# EAGLE design Controller (EAGLE 9.4.2)
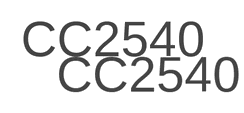
[diagram p0: schematic, sheet 1, part 1 of 3]
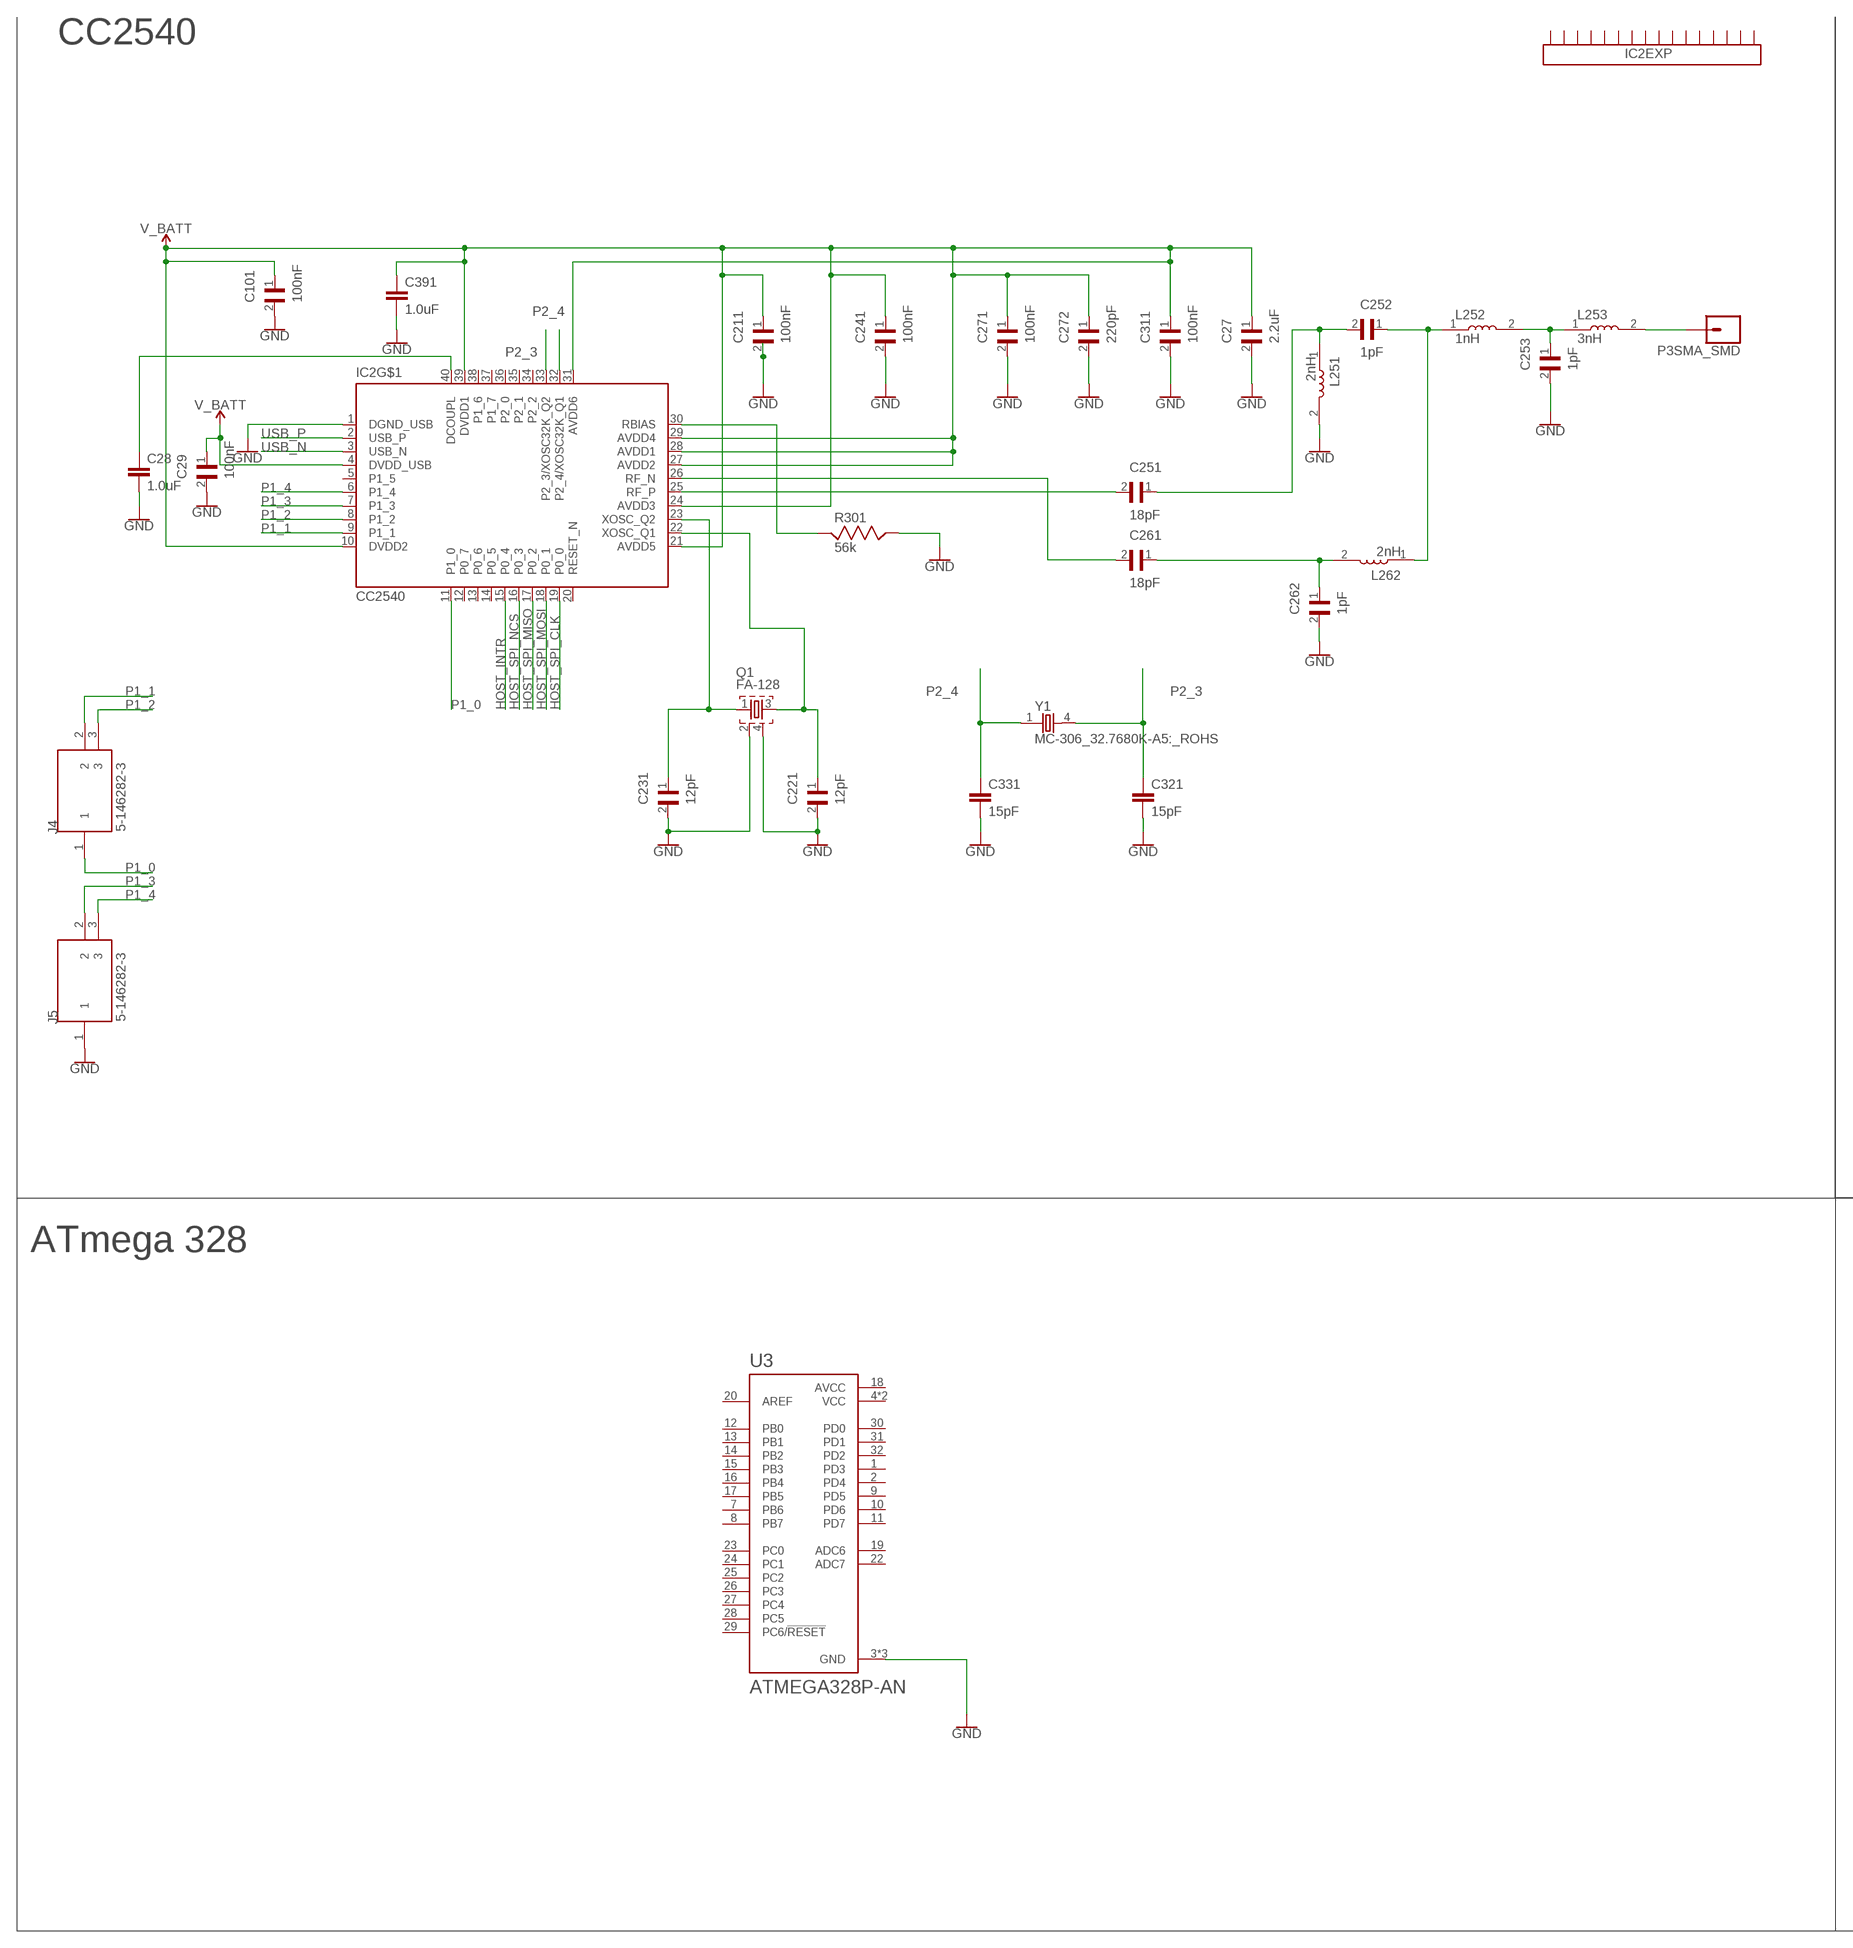
[diagram p1: schematic, sheet 1, part 2 of 3]
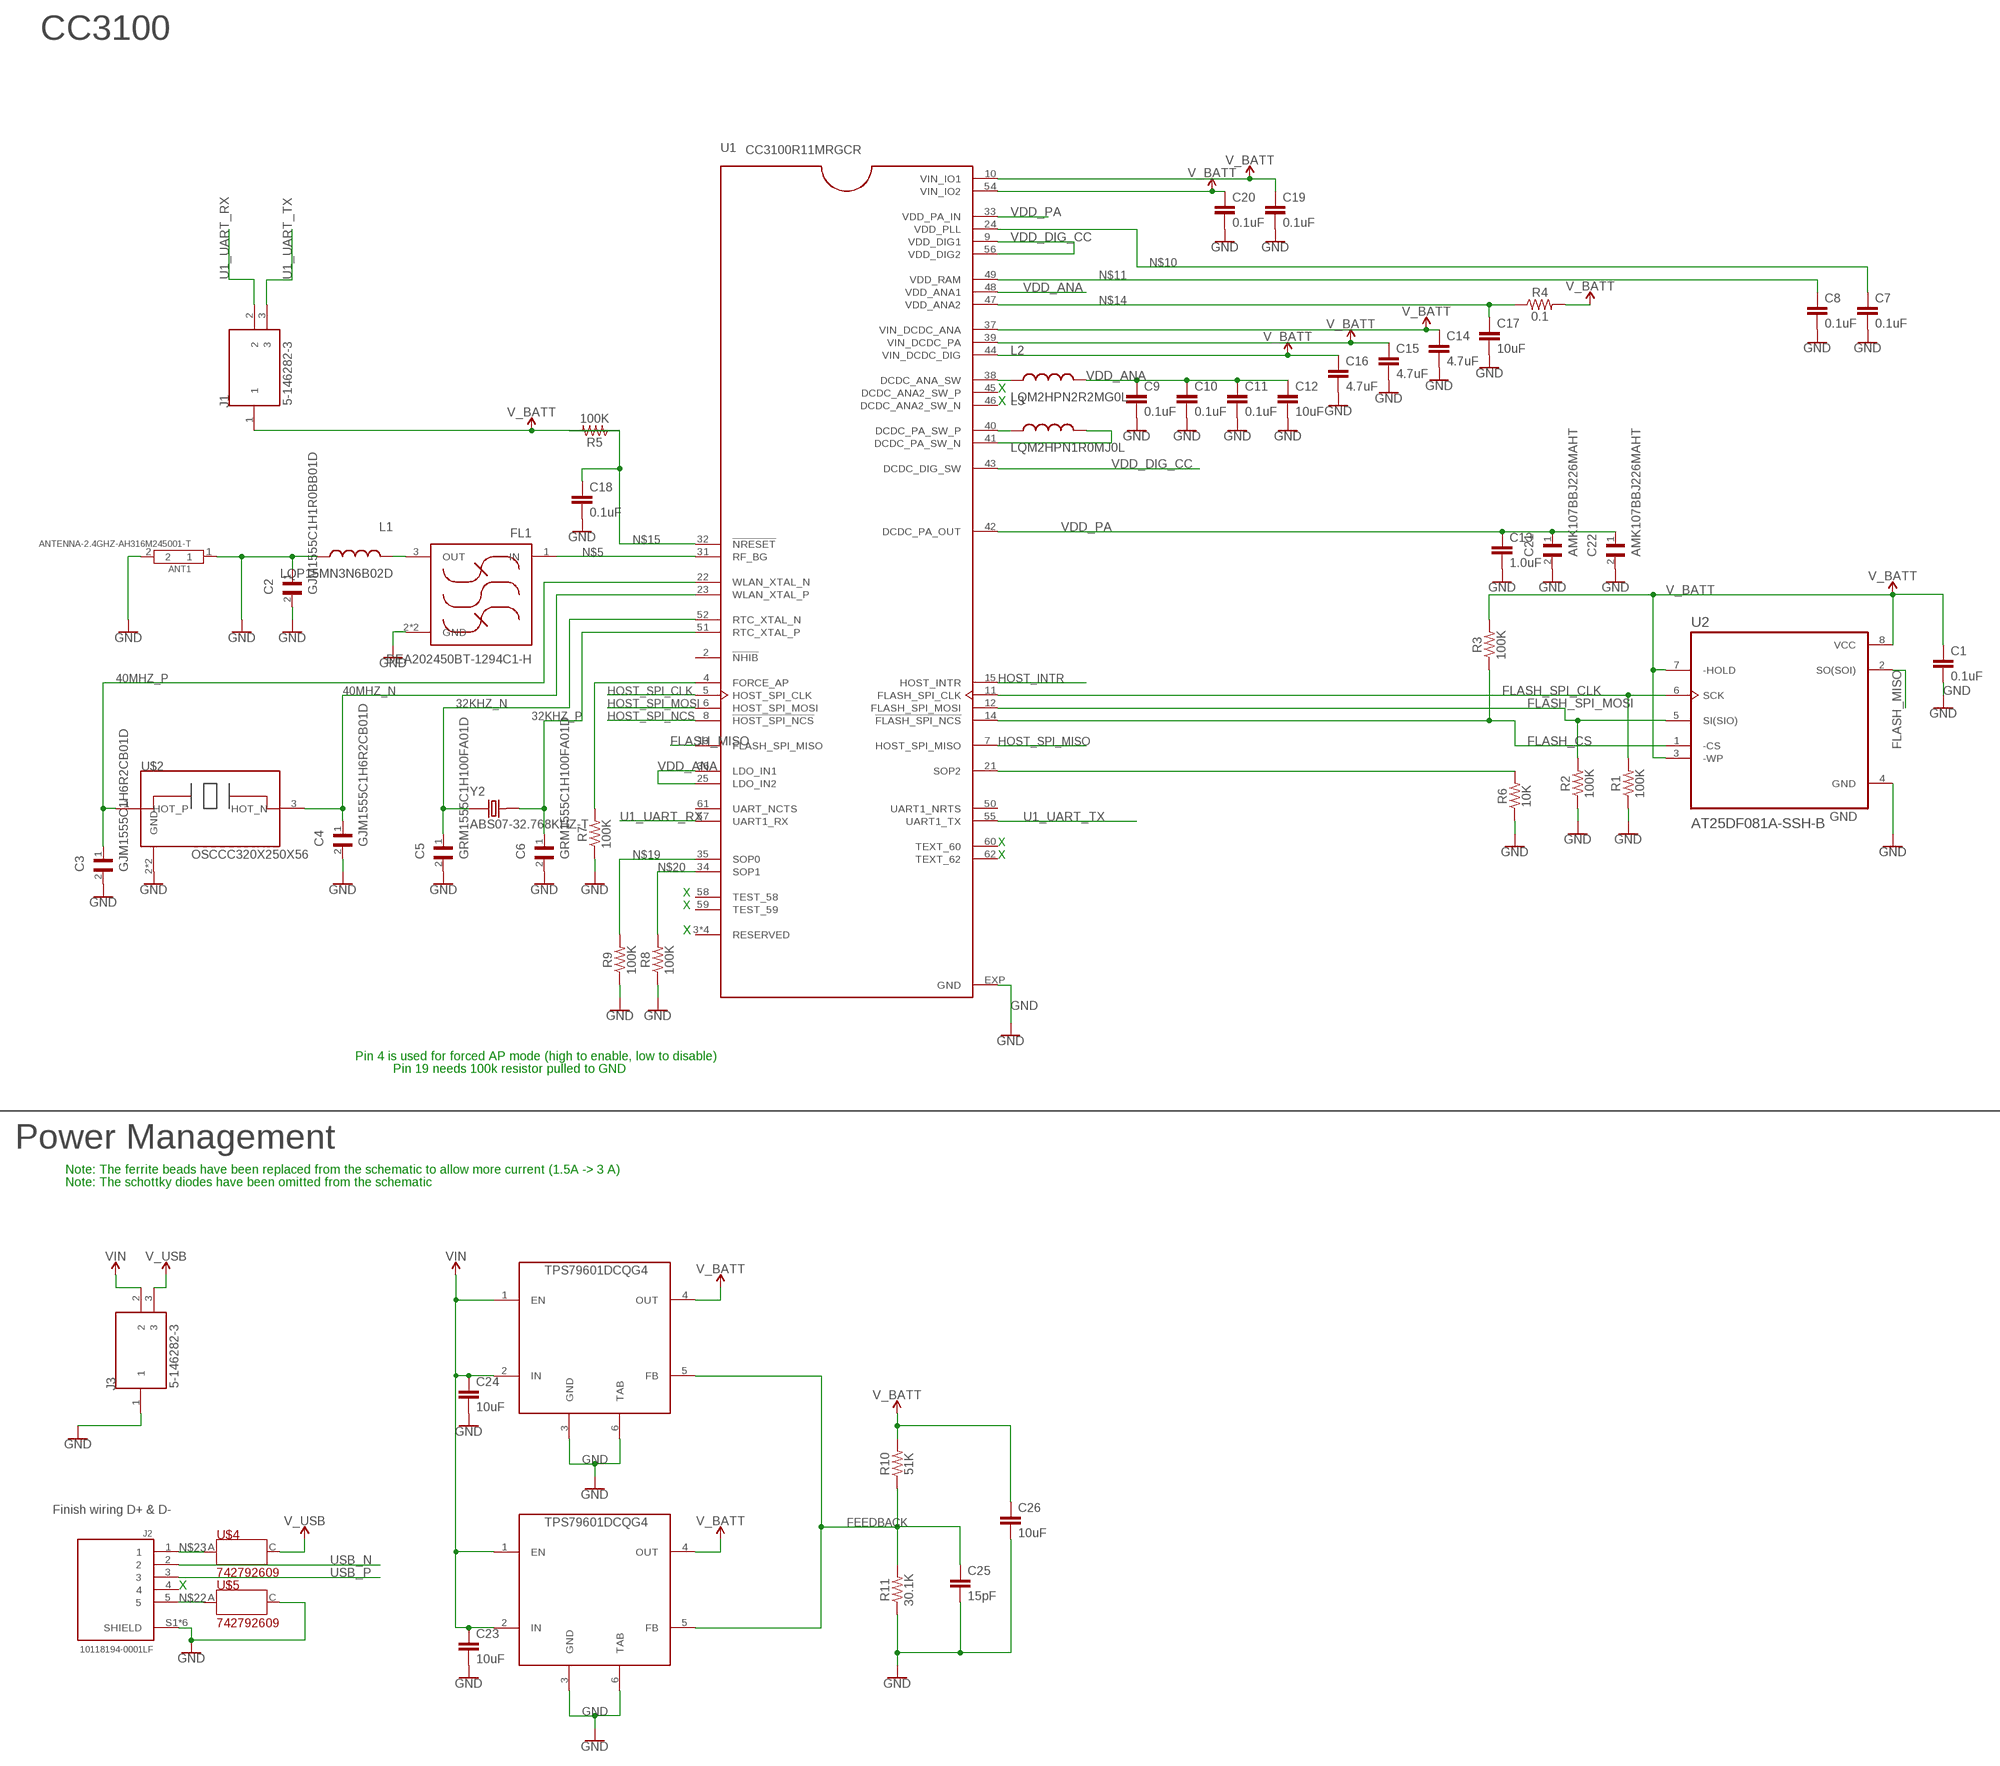
[diagram p2: schematic, sheet 1, part 3 of 3]

## Parts
ANT1  ANTENNA-2.4GHZ-AH316M245001-T  [ANT2-SMD-3.2X1.6X0.5MM]
C1  0.1uF  0.1UF-0402-16V-10%  [0402]
C2  GJM1555C1H1R0BB01D  [CAPC1005X55N]
C3  GJM1555C1H6R2CB01D  [CAPC1005X55N]
C4  GJM1555C1H6R2CB01D  [CAPC1005X55N]
C5  GRM1555C1H100FA01D  [CAPC1005X55N]
C6  GRM1555C1H100FA01D  [CAPC1005X55N]
C7  0.1uF  0.1UF-0402-16V-10%  [0402]
C8  0.1uF  0.1UF-0402-16V-10%  [0402]
C9  0.1uF  0.1UF-0402-16V-10%  [0402]
C10  0.1uF  0.1UF-0402-16V-10%  [0402]
C11  0.1uF  0.1UF-0402-16V-10%  [0402]
C12  10uF  10UF-0603-6.3V-20%  [0603]
C13  1.0uF  1.0UF-0402-16V-10%  [0402]
C14  4.7uF  4.7UF-0402_TIGHT-6.3V-20%-X5R  [0402-TIGHT]
C15  4.7uF  4.7UF-0402_TIGHT-6.3V-20%-X5R  [0402-TIGHT]
C16  4.7uF  4.7UF-0402_TIGHT-6.3V-20%-X5R  [0402-TIGHT]
C17  10uF  10UF-0603-6.3V-20%  [0603]
C18  0.1uF  0.1UF-0402-16V-10%  [0402]
C19  0.1uF  0.1UF-0402-16V-10%  [0402]
C20  0.1uF  0.1UF-0402-16V-10%  [0402]
C21  AMK107BBJ226MAHT  [CAPC1608X95N]
C22  AMK107BBJ226MAHT  [CAPC1608X95N]
C23  10uF  10UF-0603-6.3V-20%  [0603]
C24  10uF  10UF-0603-6.3V-20%  [0603]
C25  15pF  15PF-0402-50V-5%  [0402]
C26  10uF  10UF-0603-6.3V-20%  [0603]
C27  2.2uF  GRM155C81C225ME15D  [CAPC1005X55N]
C28  1.0uF  1.0UF-0402-16V-10%  [0402]
C29  100nF  C0402C104Z8VACTU  [CAPC1005X55N]
C101  100nF  C0402C104Z8VACTU  [CAPC1005X55N]
C211  100nF  C0402C104Z8VACTU  [CAPC1005X55N]
C221  12pF  C0402C120C8GACTU  [CAPC1005X55N]
C231  12pF  C0402C120C8GACTU  [CAPC1005X55N]
C241  100nF  C0402C104Z8VACTU  [CAPC1005X55N]
C251  18pF  CBR04C180J5GAC  [CAPC1005X55N]
C252  1pF  C0402C104Z8VACTU  [CAPC1005X55N]
C253  1pF  GJM1555C1H1R0BB01D  [CAPC1005X55N]
C261  18pF  CBR04C180J5GAC  [CAPC1005X55N]
C262  1pF  GJM1555C1H1R0BB01D  [CAPC1005X55N]
C271  100nF  C0402C104Z8VACTU  [CAPC1005X55N]
C272  220pF  C0402C221K8RACTU  [CAPC1005X55N]
C311  100nF  C0402C104Z8VACTU  [CAPC1005X55N]
C321  15pF  15PF-0402-50V-5%  [0402]
C331  15pF  15PF-0402-50V-5%  [0402]
C391  1.0uF  1.0UF-0402-16V-10%  [0402]
FL1  DEA202450BT-1294C1-H  [FIL_DEA202450BT-1294C1-H]
IC2  CC2540  [QFN40-6X6]
J1  5-146282-3  [TE_5-146282-3]
J2  10118194-0001LF  [AMPHENOL_10118194-0001LF]
J3  5-146282-3  [TE_5-146282-3]
J4  5-146282-3  [TE_5-146282-3]
J5  5-146282-3  [TE_5-146282-3]
L1  LQP15MN3N6B02D  [INDC0402X01]
L2  LQM2HPN2R2MG0L  [INDC1008X04]
L3  LQM2HPN1R0MJ0L  [INDC1008X04]
L251  2nH  LQG15HS2N0S02D  [INDC1005X45]
L252  1nH  LQG15HS1N0S02D  [INDC1005X45]
L253  3nH  LQG15HS3N0S02D  [INDC1005X45]
L262  2nH  LQG15HS2N0S02D  [INDC1005X45]
P3SMA_SMD  CONN_01  [1X01]
Q1  FA-128  [FA-128]
R1  100K  100KOHM-0402-1/16W-1%  [0402]
R2  100K  100KOHM-0402-1/16W-1%  [0402]
R3  100K  100KOHM-0402-1/16W-1%  [0402]
R4  0.1  0OHM-0603-1/10W  [0603]
R5  100K  100KOHM-0402-1/16W-1%  [0402]
R6  10K  100KOHM-0402-1/16W-1%  [0402]
R7  100K  100KOHM-0402-1/16W-1%  [0402]
R8  100K  100KOHM-0402-1/16W-1%  [0402]
R9  100K  100KOHM-0402-1/16W-1%  [0402]
R10  51K  22OHM-0402-1/10W-1%  [0402]
R11  30.1K  22OHM-0402-1/10W-1%  [0402]
R301  56k  RC0402FR-1356KL  [RESC1005X40]
U1  CC3100R11MRGCR  [QFN50P900X900X100-65N]
U2  AT25DF081A-SSH-B  [SOIC127P600X175-8N]
U3  ATMEGA328P-AN  [QFP80P900X900X120-32N]
U$1  TPS79601DCQG4  [SOT127P706X180-6N]
U$2  OSCCC320X250X56  [OSCCC320X250X56]
U$3  TPS79601DCQG4  [SOT127P706X180-6N]
U$4  742792609  [LEDM1608X80]
U$5  742792609  [LEDM1608X80]
Y1  MC-306_32.7680K-A5:_ROHS  [OSCL550P800X320X254-4N]
Y2  ABS07-32.768KHZ-T  [XTAL_ABS07-32.768KHZ-T]

## Nets
32KHZ_N: C5.1 U1.52(RTC_XTAL_N) Y2.1
32KHZ_P: C6.1 U1.51(RTC_XTAL_P) Y2.2
40MHZ_N: C4.1 U1.23(WLAN_XTAL_P) U$2.3(HOT_N)
40MHZ_P: C3.1 U1.22(WLAN_XTAL_N) U$2.1(HOT_P)
FEEDBACK: C25.1 R10.1 R11.2 U$1.5(FB) U$3.5(FB)
FLASH_CS: R3.1 U1.14(!FLASH_SPI_NCS) U2.1(-CS)
FLASH_MISO: U1.13(FLASH_SPI_MISO) U2.2(SO(SOI))
FLASH_SPI_CLK: R1.2 U1.11(FLASH_SPI_CLK) U2.6(SCK)
FLASH_SPI_MOSI: R2.2 U1.12(FLASH_SPI_MOSI) U2.5(SI(SIO))
GND: ANT1.1 ANT1.2 C1.2 C2.1 C2.2 C3.2 C4.2 C5.2 C6.2 C7.2 C8.2 C9.2 C10.2 C11.2 C12.2 C13.2 C14.2 C15.2 C16.2 C17.2 C18.2 C19.2 C20.2 C21.2 C22.2 C23.2 C24.2 C25.2 C26.2 C27.2 C28.2 C29.2 C101.2 C211.2 C221.2 C231.2 C241.2 C253.2 C262.2 C271.2 C272.2 C311.2 C321.2 C331.2 C391.2 FL1.2(GND) FL1.4(GND) J2.S1(SHIELD) J2.S2(SHIELD) J2.S3(SHIELD) J2.S4(SHIELD) J2.S5(SHIELD) J2.S6(SHIELD) J3.1 J5.1 L1.2 L251.2 Q1.2 Q1.4 R1.1 R2.1 R6.1 R7.1 R8.1 R9.1 R11.1 R301.2 U1.EXP(GND) U2.4(GND) U3.3(GND) U3.5(GND) U3.21(GND) U$1.3(GND) U$1.6(TAB) U$2.2(GND) U$2.4(GND) U$3.3(GND) U$3.6(TAB) U$5.C
HOST_INTR: IC2.15(P0_4) U1.15(HOST_INTR)
HOST_SPI_CLK: IC2.19(P0_0) U1.5(HOST_SPI_CLK)
HOST_SPI_MISO: IC2.17(P0_2) U1.7(HOST_SPI_MISO)
HOST_SPI_MOSI: IC2.18(P0_1) U1.6(HOST_SPI_MOSI)
HOST_SPI_NCS: IC2.16(P0_3) U1.8(!HOST_SPI_NCS)
N$5: FL1.1(IN) U1.31(RF_BG)
N$6: FL1.3(OUT) L1.1
N$10: C7.1 U1.24(VDD_PLL)
N$11: C8.1 U1.49(VDD_RAM)
N$12: R6.2 U1.21(SOP2)
N$13: L2.1 U1.38(DCDC_ANA_SW)
N$14: C17.1 R4.1 U1.47(VDD_ANA2)
N$15: C18.1 R5.1 U1.32(!NRESET)
N$16: L3.1 U1.40(DCDC_PA_SW_P)
N$17: L3.2 U1.41(DCDC_PA_SW_N)
N$18: R7.2 U1.4(FORCE_AP)
N$19: R9.2 U1.35(SOP0)
N$20: R8.2 U1.34(SOP1)
N$21: IC2.1(DGND_USB) ; supply symbol labelled GND
N$22: J2.5 U$5.A
N$23: J2.1 U$4.A
N$24: C251.2 IC2.25(RF_P)
N$26: C261.2 IC2.26(RF_N)
N$27: C251.1 C252.2 L251.1
N$28: C261.1 C262.1 L262.2
N$29: C252.1 L252.1 L262.1
N$30: C253.1 L252.2 L253.1
N$31: L253.2 P3SMA_SMD.1
N$32: C231.1 IC2.23(XOSC_Q2) Q1.1
N$33: C221.1 IC2.22(XOSC_Q1) Q1.3
N$34: C28.1 IC2.40(DCOUPL)
N$35: IC2.30(RBIAS) R301.1
P1_0: IC2.11(P1_0) J4.1
P1_1: IC2.9(P1_1) J4.2
P1_2: IC2.8(P1_2) J4.3
P1_3: IC2.7(P1_3) J5.2
P1_4: IC2.6(P1_4) J5.3
P2_3: C321.1 IC2.33(P2_3/XOSC32K_Q2) Y1.4
P2_4: C331.1 IC2.32(P2_4/XOSC32K_Q1) Y1.1
U1_UART_RX: J1.2 U1.57(UART1_RX)
U1_UART_TX: J1.3 U1.55(UART1_TX)
USB_N: IC2.3(USB_N) J2.2
USB_P: IC2.2(USB_P) J2.3
V_BATT: C1.1 C14.1 C15.1 C16.1 C19.1 C20.1 C26.1 C27.1 C29.1 C101.1 C211.1 C241.1 C271.1 C272.1 C311.1 C391.1 IC2.4(DVDD_USB) IC2.10(DVDD2) IC2.21(AVDD5) IC2.24(AVDD3) IC2.27(AVDD2) IC2.28(AVDD1) IC2.29(AVDD4) IC2.31(AVDD6) IC2.39(DVDD1) J1.1 R3.2 R4.2 R5.2 R10.2 U1.10(VIN_IO1) U1.37(VIN_DCDC_ANA) U1.39(VIN_DCDC_PA) U1.44(VIN_DCDC_DIG) U1.54(VIN_IO2) U2.3(-WP) U2.7(-HOLD) U2.8(VCC) U$1.4(OUT) U$3.4(OUT)
V_USB: J3.3 U$4.C
VDD_ANA: C9.1 C10.1 C11.1 C12.1 L2.2 U1.25(LDO_IN2) U1.36(LDO_IN1) U1.48(VDD_ANA1)
VDD_DIG_CC: U1.9(VDD_DIG1) U1.43(DCDC_DIG_SW) U1.56(VDD_DIG2)
VDD_PA: C13.1 C21.1 C22.1 U1.33(VDD_PA_IN) U1.42(DCDC_PA_OUT)
VIN: C23.1 C24.1 J3.2 U$1.1(EN) U$1.2(IN) U$3.1(EN) U$3.2(IN)
Unconnected: IC2.5(P1_5) IC2.12(P0_7) IC2.13(P0_6) IC2.14(P0_5) IC2.20(RESET_N) IC2.34(P2_2) IC2.35(P2_1) IC2.36(P2_0) IC2.37(P1_7) IC2.38(P1_6) IC2.EXP@1(EXP:EXP16) IC2.EXP@2(EXP:EXP16) IC2.EXP@3(EXP:EXP16) IC2.EXP@4(EXP:EXP16) IC2.EXP@5(EXP:EXP16) IC2.EXP@6(EXP:EXP16) IC2.EXP@7(EXP:EXP16) IC2.EXP@8(EXP:EXP16) IC2.EXP@9(EXP:EXP16) IC2.EXP@10(EXP:EXP16) IC2.EXP@11(EXP:EXP16) IC2.EXP@12(EXP:EXP16) IC2.EXP@13(EXP:EXP16) IC2.EXP@14(EXP:EXP16) IC2.EXP@15(EXP:EXP16) IC2.EXP@16(EXP:EXP16) J2.4 U1.2(!NHIB) U1.3(RESERVED) U1.19(RESERVED) U1.29(RESERVED) U1.30(RESERVED) U1.50(UART1_NRTS) U1.58(TEST_58) U1.59(TEST_59) U1.60(TEXT_60) U1.61(UART_NCTS) U1.62(TEXT_62) U3.1(PD3) U3.2(PD4) U3.7(PB6) U3.8(PB7) U3.9(PD5) U3.10(PD6) U3.11(PD7) U3.12(PB0) U3.13(PB1) U3.14(PB2) U3.15(PB3) U3.16(PB4) U3.17(PB5) U3.19(ADC6) U3.20(AREF) U3.22(ADC7) U3.23(PC0) U3.24(PC1) U3.25(PC2) U3.26(PC3) U3.27(PC4) U3.28(PC5) U3.29(PC6/!RESET) U3.30(PD0) U3.31(PD1) U3.32(PD2)

## Notes on the sheet
- CC2540
- CC2540
- CC2540 | CC3100
- X
- X
- X
- X
- X
- X
- X
- Pin 4 is used for forced AP mode (high to enable, low to disable)
- Pin 19 needs 100k resistor pulled to GND
- Power Management
- ATmega 328
- Note: The ferrite beads have been replaced from the schematic to allow more current (1.5A -> 3 A)
- Note: The schottky diodes have been omitted from the schematic
- Finish wiring D+ & D-
- X

## Power pins joined to a net without a drawn wire
AVCC: U3.18(AVCC)
DCDC_ANA2_SW_N: U1.46(DCDC_ANA2_SW_N)
DCDC_ANA2_SW_P: U1.45(DCDC_ANA2_SW_P)
VCC: U3.4(VCC) U3.6(VCC)

## Library data of the parts
ANT1 = ANTENNA-2.4GHZ-AH316M245001-T:ANTENNA-2.4GHZ-AH316M245001-T: 318010018; DESCRIPTION: ANTENNA, GPS, 2450MHZ; Antenna Type: Multilayer; VSWR: 2; Antenna Polarization: -; Antenna Case Size: -; Antenna Appl...; DIGI-KEY_PART_NUMBER: 587-2200-1-ND; DIGI-KEY_PURCHASE_URL: https://www.digikey.com/product-detail/en/taiyo-yuden/AH316M245001-T/587-2200-1-ND/2002898?utm_source=snapeda&utm_medium=aggregator&utm_campaign=symbol; MF: Taiyo Yuden; MP: AH316M245001-T; PACKAGE: AH 316M Taiyo Yuden
C1 C7-C11 C18-C20 = SparkFun-Capacitors:0.1UF: 0.1µF ceramic capacitors A capacitor is a passive two-terminal electrical component used to store electrical energy temporarily in an electric field.; PROD_ID: CAP-12416
C2 = GJM1555C1H1R0BB01D:GJM1555C1H1R0BB01D: Cap Ceramic 1pF 50V C0G 0.1pF SMD 0402 125°C Paper T/R; AVAILABILITY: Unavailable; DESCRIPTION: 0402 1 pF 50 V ±0.1 pF Tolerance C0G SMT Multilayer Ceramic Capacitor; MF: Murata; MP: GJM1555C1H1R0BB01D; PACKAGE: 0402 Murata; PRICE: None
C3 C4 = GJM1555C1H6R2CB01D:GJM1555C1H6R2CB01D: Cap Ceramic 6.2pF 50V C0G 0.25pF SMD 0402 125°C Paper T/R; DESCRIPTION: 0402 6.2 pF 50V ±0.25 pF Tolerance C0G SMT Multilayer Ceramic Capacitor; DIGI-KEY_PART_NUMBER: 490-3105-1-ND; DIGI-KEY_PURCHASE_URL: https://www.digikey.com/product-detail/en/murata-electronics-north-america/GJM1555C1H6R2CB01D/490-3105-1-ND/702371?utm_source=snapeda&utm_medium=aggregator&utm_campaign=symbol; MF: Murata; MP: GJM1555C1H6R2CB01D; PACKAGE: 0402 Murata
C5 C6 = GRM1555C1H100FA01D:GRM1555C1H100FA01D: KC 10pF 0402 1% 50V NP0; AVAILABILITY: Unavailable; DESCRIPTION: 0402 10 pF 50 V ±1% Tolerance C0G SMT Multilayer Ceramic Capacitor; MF: Murata; MP: GRM1555C1H100FA01D; PACKAGE: 0402 Murata; PRICE: None
C12 C17 C23 C24 C26 = SparkFun-Capacitors:10UF: 10.0µF ceramic capacitors A capacitor is a passive two-terminal electrical component used to store electrical energy temporarily in an electric field.; PROD_ID: CAP-11015
C13 C28 C391 = SparkFun-Capacitors:1.0UF: 1µF ceramic capacitors A capacitor is a passive two-terminal electrical component used to store electrical energy temporarily in an electric field.; PROD_ID: CAP-12417
C14-C16 = SparkFun-Capacitors:4.7UF: 4.7µF ceramic capacitors A capacitor is a passive two-terminal electrical component used to store electrical energy temporarily in an electric field.; PROD_ID: CAP-14240
C21 C22 = AMK107BBJ226MAHT:AMK107BBJ226MAHT: CAP CER 22UF 4V X5R 0603; DESCRIPTION: CAP , MLCC , 0603, 4V , X5R, 22uF 20% , T&R; DIGI-KEY_PART_NUMBER: 587-3262-1-ND; DIGI-KEY_PURCHASE_URL: https://www.digikey.com/product-detail/en/taiyo-yuden/AMK107BBJ226MAHT/587-3262-1-ND/4157229?utm_source=snapeda&utm_medium=aggregator&utm_campaign=symbol; MF: Taiyo Yuden; MP: AMK107BBJ226MAHT; PACKAGE: 0603 Taiyo Yuden
C25 C321 C331 = SparkFun-Capacitors:15PF: 15pF ceramic capacitors A capacitor is a passive two-terminal electrical component used to store electrical energy temporarily in an electric field.; PROD_ID: CAP-13063
C27 = 2_2uf Cap 0402:GRM155C81C225ME15D: CAP 2.2UF 16VDC Z6S 20% SMD 0402 PAPER TAPE; AVAILABILITY: Unavailable; DESCRIPTION: Cap 2.2uf 16vdc Z6s 20% Smd 0402 Paper Tape; MF: Murata; MP: GRM155C81C225ME15D; PACKAGE: 0402 Murata; PRICE: None
C29 C101 C211 C241 C252 C271 C311 = 100nF Cap 0402:C0402C104Z8VACTU: Cap Ceramic 0.1uF 10V Y5V -20% to 80% SMD 0402 85°C Paper T/R; AVAILABILITY: Unavailable; DESCRIPTION: Capacitor, Ceramic, 100nF, 10VDC, 20-% Tol, 80+% Tol, Y5V-TC Code, -82, 22%-TC; MF: KEMET; MP: C0402C104Z8VACTU; PACKAGE: 0402 KEMET; PRICE: None
C221 C231 = 12pF Cap 0402:C0402C120C8GACTU: Cap Ceramic 12pF 10V C0G 0.25pF SMD 0402 125°C Paper T/R; AVAILABILITY: Unavailable; DESCRIPTION: Cap Ceramic 12pF 10V C0G 0.25pF SMD 0402 125°C Paper T/R; MF: KEMET; MP: C0402C120C8GACTU; PACKAGE: 0402 KEMET; PRICE: None
C251 C261 = 18pf Cap 0402:CBR04C180J5GAC: Cap Ceramic 18pF 50V C0G 5% SMD 0402 125°C Paper T/R; AVAILABILITY: Unavailable; DESCRIPTION: Cap Ceramic 18pF 50V C0G 5% SMD 0402 125°C Paper T/R; MF: KEMET; MP: CBR04C180J5GAC; PACKAGE: 0402 KEMET; PRICE: None
C253 C262 = 1pF Cap 0402:GJM1555C1H1R0BB01D: Cap Ceramic 1pF 50V C0G 0.1pF SMD 0402 125°C Paper T/R; AVAILABILITY: Unavailable; DESCRIPTION: 0402 1 pF 50 V ±0.1 pF Tolerance C0G SMT Multilayer Ceramic Capacitor; MF: Murata; MP: GJM1555C1H1R0BB01D; PACKAGE: 0402 Murata; PRICE: None
C272 = 220pF Cap 0402:C0402C221K8RACTU: Cap Ceramic 220pF 10V X7R 10% SMD 0402 125°C Paper T/R; AVAILABILITY: Unavailable; DESCRIPTION: Capacitor, Ceramic, 220pF, 10VDC, 10-% Tol, 10+% Tol, X7R-TC Code, -15, 15%-TC; MF: KEMET; MP: C0402C221K8RACTU; PACKAGE: 0402 KEMET; PRICE: None
FL1 = DEA202450BT-1294C1-H:DEA202450BT-1294C1-H: BANDPASS FILTER WLAN BLUETOOTH 2.4GHz 2012 SIZE; DESCRIPTION: BANDPASS FILTER WLAN BLUETOOTH 2.4GHz 2012 SIZE; DIGI-KEY_PART_NUMBER: 445-172335-1-ND; DIGI-KEY_PURCHASE_URL: https://www.digikey.com/product-detail/en/tdk-corporation/DEA202450BT-1294C1-H/445-172335-1-ND/4876440?utm_source=snapeda&utm_medium=aggregator&utm_campaign=symbol; MF: TDK; MP: DEA202450BT-1294C1-H; PACKAGE: 0805 TDK
IC2 = texas:CC2540: 2.4-GHz Bluetooth® low energy System-on-Chip Auto generated by make-symbol-device-package-bsdl.ulp Rev. 39 Source: cc2540.txt
J1 J3-J5 = 5-146282-3:5-146282-3: 03 MODII HDR SRST B/A .100CL; AVAILABILITY: Unavailable; CENTERLINE_PITCH: 2.54 mm[.1 in]; COMMENT: 5-146282-3; DESCRIPTION: 03 MODII HDR SRST B/A .100CL; EU_ROHS_COMPLIANCE: Compliant; MF: TE Connectivity; MP: 5-146282-3; NUMBER_OF_POSITIONS: 3; PACKAGE: None; PRICE: None; PRODUCT_TYPE: Connector; TE_PURCHASE_URL: https://www.te.com/usa-en/product-5-146282-3.html?te_bu=Cor&te_type=disp&te_campaign=seda_glo_cor-seda-global-disp-prtnr-fy19-seda-model-bom-cta_sma-317_1&elqCampaignId=32493
J2 = 10118194-0001LF:10118194-0001LF: Micro Usb, 2.0 Type b, Rcpt, Smt; DESCRIPTION: Micro Usb, 2.0 Type b, Rcpt, Smt; DIGI-KEY_PART_NUMBER: 609-4618-1-ND; DIGI-KEY_PURCHASE_URL: https://www.digikey.com/product-detail/en/amphenol-icc-fci/10118194-0001LF/609-4618-1-ND/2785382?utm_source=snapeda&utm_medium=aggregator&utm_campaign=symbol; MF: Amphenol ICC; MP: 10118194-0001LF; PACKAGE: None
L1 = LQP15MN3N6B02D:LQP15MN3N6B02D: Inductor RF Chip Thin Film 3.6nH 0.1nH 500MHz 13Q-Factor 170mA 500mOhm DCR 0402 Paper T/R; DESCRIPTION: Inductor RF Chip Thin Film 3.6nH 0.1nH 500MHz 13Q-Factor 170mA 500mOhm DCR 0402 Paper T/R; DIGI-KEY_PART_NUMBER: 490-6756-1-ND; DIGI-KEY_PURCHASE_URL: https://www.digikey.com/product-detail/en/murata-electronics-north-america/LQP15MN3N6B02D/490-6756-1-ND/3845953?utm_source=snapeda&utm_medium=aggregator&utm_campaign=symbol; MF: Murata Electronics; MP: LQP15MN3N6B02D; PACKAGE: 0402 Murata
L2 = LQM2HPN2R2MG0L:LQM2HPN2R2MG0L: Inductor Power Chip Shielded Multi-Layer 2.2uH 20% 1MHz Ferrite 1.3A 80mOhm DCR 1008 Embossed T/R; DESCRIPTION: Inductor Power Chip Shielded Multi-Layer 2.2uH 20% 1MHz Ferrite 1.3A 80mOhm DCR 1008 Embossed T/R; DIGI-KEY_PART_NUMBER: 490-5114-1-ND; DIGI-KEY_PURCHASE_URL: https://www.digikey.com/product-detail/en/murata-electronics-north-america/LQM2HPN2R2MG0L/490-5114-1-ND/1893677?utm_source=snapeda&utm_medium=aggregator&utm_campaign=symbol; MF: Murata; MP: LQM2HPN2R2MG0L; PACKAGE: 1008 Murata
L3 = LQM2HPN1R0MJ0L:LQM2HPN1R0MJ0L: Inductor Power Chip Shielded Multi-Layer 1uH 20% 1MHz Ferrite 1.5A 113mOhm DCR 1008 Embossed T/R; AVAILABILITY: Unavailable; DESCRIPTION: Inductor Power Chip Shielded Multi-Layer 1uH 20% 1MHz Ferrite 1.5A 113mOhm DCR 1008 Embossed T/R; MF: Murata Electronics; MP: LQM2HPN1R0MJ0L; PACKAGE: 1008 Murata; PRICE: None
L251 L262 = 2_2nH ind 0402:LQG15HS2N0S02D: FIXED IND 2NH 300MA 100 MOHM SMD; AVAILABILITY: Unavailable; DESCRIPTION: Inductor RF Chip Multi-Layer 2nH 0.3nH 100MHz 8Q-Factor Air 300mA 100mOhm DCR 0402 Paper T/R; MF: Murata; MP: LQG15HS2N0S02D; PACKAGE: 0402 Murata; PRICE: None
L252 = 1nH Ind 0402:LQG15HS1N0S02D: Inductor RF Chip Unshielded Multi-Layer 1nH 0.3nH 100MHz 8Q-Factor Ceramic 1A 70mOhm DCR 0402 T/R; AVAILABILITY: Unavailable; DESCRIPTION: Inductor RF Chip Multi-Layer 1nH 0.3nH 100MHz 8Q-Factor Air 300mA 70mOhm DCR 0402 Paper T/R; MF: Murata; MP: LQG15HS1N0S02D; PACKAGE: 0402 Murata; PRICE: None
L253 = 3nH Ind 0402:LQG15HS3N0S02D: INDUCTOR, 0402 CASE, 3.3NH; AVAILABILITY: Unavailable; DESCRIPTION: Inductor RF Chip Unshielded Multi-Layer 3nH 0.3nH 100MHz 8Q-Factor Ceramic 800mA 125mOhm DCR 0402 T/R; MF: Murata; MP: LQG15HS3N0S02D; PACKAGE: 0402 Murata; PRICE: None
P3SMA_SMD = SparkFun-Connectors:CONN_01: Single connection point. Often used as Generic Header-pin footprint for 0.1 inch spaced/style header connections On any of the 0.1 inch spaced packages, you can populate with these: Break Away Headers - Straight <https://www.sparkfun.com/products/116> (PRT-00116) Break Away Male Headers - Right Angle <https://www.sparkfun.com/products/553> (PRT-00553) Female Headers <https://www.sparkfun.com/products/115> (PRT-00115) Break Away Headers - Machine Pin <https://www.sparkfun.com/products/117> (PRT-00117) Break Away Female Headers - Swiss Machine Pin <https://www.sparkfun.com/products/743> (PRT-00743) This device is also useful as a general connection point to wire up your design to another part of your project. Our various solder wires solder well into these plated through hole pads. Hook-Up Wire - Assortment (Stranded, 22 AWG) <https://www.sparkfun.com/products/11375> (PRT-11375) Hook-Up Wire - Assortment (Solid Core, 22 AWG) <https://www.sparkfun.com/products/11367> (PRT-11367) View the entire wire category on our website here <https://www.sparkfun.com/categories/141> Special notes: SMTSO-256-ET is a "flush mount" nut for a 4-40 screw. We mostly use this on specialty testbeds; it is a nice way to connect hardware to your PCB at an adjustable hieght. Also note, the SNAP packages are for using a snappable style connector. We sell a baggie of snaps and they are also used on two LilyPad designs: Snap Assortment - 30 pack (male and female) <https://www.sparkfun.com/products/11347> (DEV-11347) LilyPad Arduino SimpleSnap <https://www.sparkfun.com/products/10941> (DEV-10941) LilyPad SimpleSnap Protoboard <https://www.sparkfun.com/products/10940> (DEV-10940)
Q1 = crystal:FA-: MHz RANGE CRYSTAL UNIT Source: Epson Toyocom
R1-R3 R5 R7-R9 = SparkFun-Resistors:100KOHM: 100kΩ resistor A resistor is a passive two-terminal electrical component that implements electrical resistance as a circuit element. Resistors act to reduce current flow, and, at the same time, act to lower voltage levels within circuits. - Wikipedia; PROD_ID: RES-13495
R4 = SparkFun-Resistors:0OHM: 0Ω resistor A resistor is a passive two-terminal electrical component that implements electrical resistance as a circuit element. Resistors act to reduce current flow, and, at the same time, act to lower voltage levels within circuits. - Wikipedia; PROD_ID: RES-08609; VALUE: 0
R6 = SparkFun-Resistors:100KOHM: 100kΩ resistor A resistor is a passive two-terminal electrical component that implements electrical resistance as a circuit element. Resistors act to reduce current flow, and, at the same time, act to lower voltage levels within circuits. - Wikipedia; PROD_ID: RES-13495; VALUE: 100K
R10 R11 = SparkFun-Resistors:22OHM: 22Ω resistor A resistor is a passive two-terminal electrical component that implements electrical resistance as a circuit element. Resistors act to reduce current flow, and, at the same time, act to lower voltage levels within circuits. - Wikipedia; PROD_ID: RES-12427; VALUE: 22
R301 = 1-56K Res 0402:RC0402FR-1356KL: RC Series 0402 62.5 mW 100 kOhms 1% ±100 ppm/°C SMT Thick Film Chip Resistor; AVAILABILITY: Unavailable; DESCRIPTION: Res Thick Film 0402 56K Ohm 1% 1/16W ±100ppm/°C Molded SMD SMD Paper T/R; MF: Yageo; MP: RC0402FR-1356KL; PACKAGE: 0402 Yageo; PRICE: None
U1 = CC3100R11MRGCR:CC3100R11MRGCR: CC3100 SimpleLink Wi-Fi Network Processor, Internet-of-Things Solution for MCU Applications; AVAILABILITY: Unavailable; DESCRIPTION: SimpleLink™ Wi-Fi® Network Processor, Internet-of-Things Solution for MCU Applications 64-VQFN -40 to 85; MF: Texas Instruments; MP: CC3100R11MRGCR; PACKAGE: VFQFN-64 Texas Instruments; PRICE: None
U2 = AT25DF081A-SSH-B:AT25DF081A-SSH-B: None; AVAILABILITY: Unavailable; DESCRIPTION: Flash Mem Serial-SPI 3.3V 8M-Bit 1M x 8 8-Pin SOIC W Bulk; MF: Adesto Technologies; MP: AT25DF081A-SSH-B; PACKAGE: SOIC-8 Microchip; PRICE: None
U3 = ATMEGA328P-AN:ATMEGA328P-AN: ATmega Series 20 MHz 32 KB Flash 2 KB SRAM 8-Bit Microcontroller - TQFP-32; AVAILABILITY: Unavailable; DESCRIPTION: MCU 8-bit ATmega AVR RISC 32KB Flash 2.5V/3.3V/5V 32-Pin TQFP Tray; MF: Microchip; MP: ATMEGA328P-AN; PACKAGE: TQFP-32 Microchip; PRICE: None
U$1 U$3 = SOT127P706X180-6N:TPS79601DCQG4
U$2 = OSCCC320X250X56:OSCCC320X250X56: 40MHz 8pF SMD XOSC
U$4 U$5 = LEDM1608X80:742792609
Y1 = 1MC-306_32.7680K-A5__ROHS:MC-306_32.7680K-A5:_ROHS: kHz RANGE CRYSTAL UNIT; AVAILABILITY: Unavailable; DESCRIPTION: Crystal 32.7680 Khz 12.5pf Smd; MF: Epson; MP: MC-306 32.7680K-A5: ROHS; PACKAGE: 4-4 Epson; PRICE: None
Y2 = ABS07-32.768KHZ-T:ABS07-32.768KHZ-T: ABS07 Series 32.768 kHz ±20 ppm 12.5 pF -40 to +85 °C SMT Low Profile Crystal; DESCRIPTION: ABS07 Series 32.768 kHz ±20 ppm 12.5 pF -40 to +85 °C SMT Low Profile Crystal; DIGI-KEY_PART_NUMBER: 535-9542-1-ND; DIGI-KEY_PURCHASE_URL: https://www.digikey.com/product-detail/en/abracon-llc/ABS07-32.768KHZ-T/535-9542-1-ND/1237009?utm_source=snapeda&utm_medium=aggregator&utm_campaign=symbol; MF: Abracon; MP: ABS07-32.768KHZ-T; PACKAGE: SMD-2 Abracon

## Board
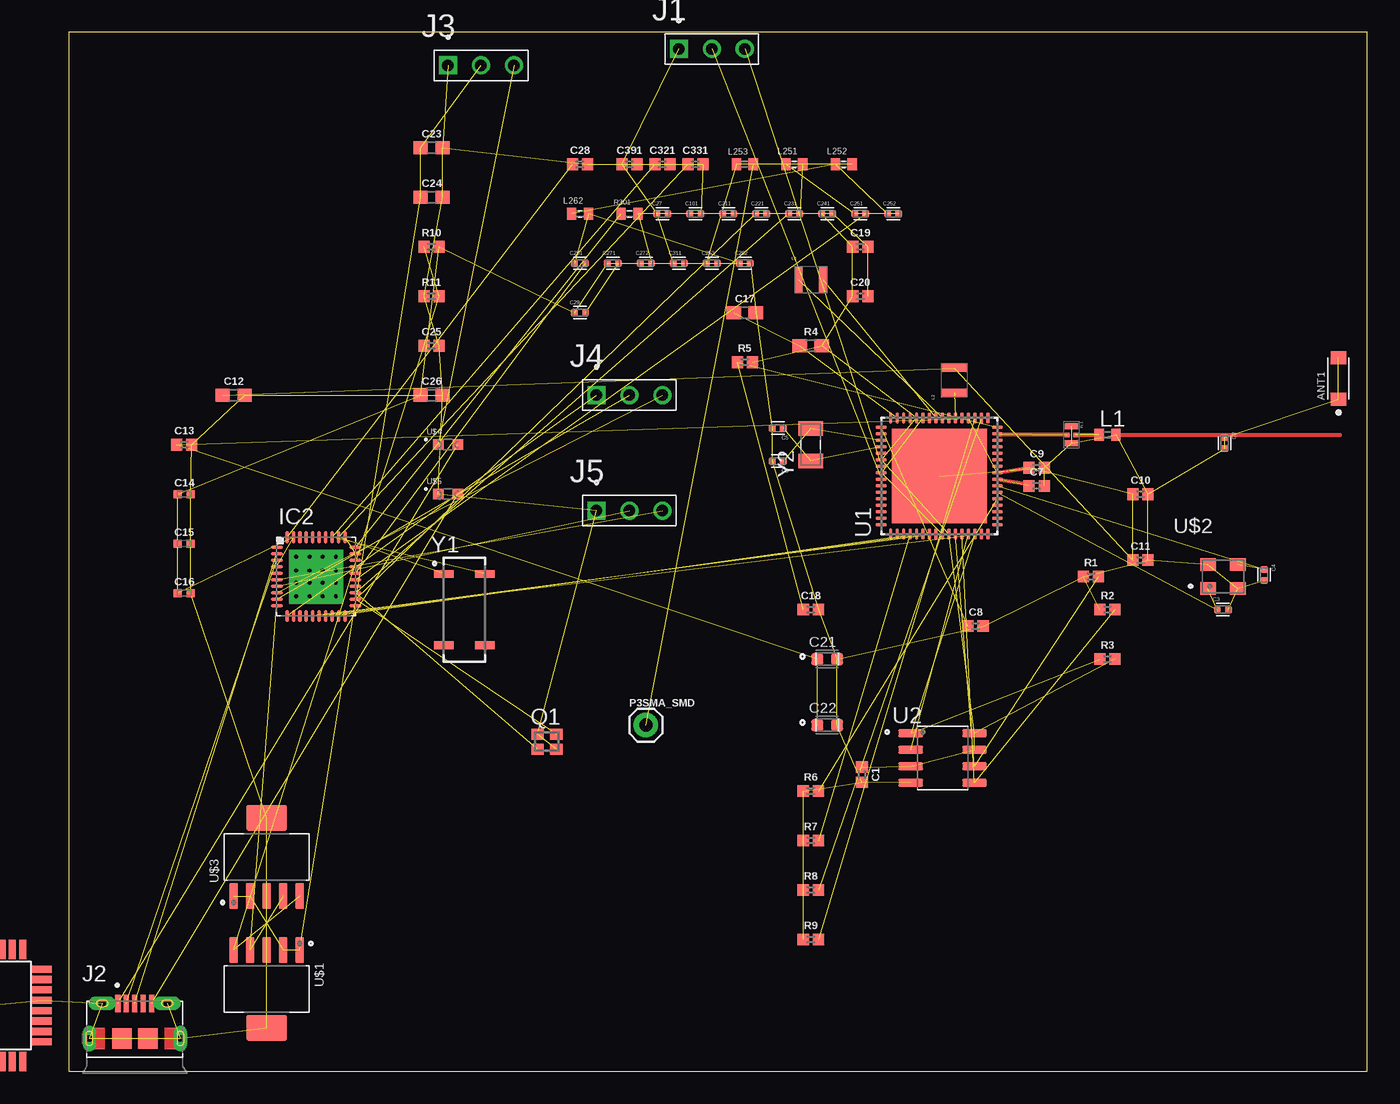
[diagram p3: board, top side]

Size 100 x 80 mm. Coordinates in mm from the lower left corner, seen from the top.
Outline: 0,0 100,0 100,80 0,80 0,0
Copper layers (1*16): Top 0.035mm / dielectric 0.15mm / Bottom 0.035mm
Design rules "default": minimum track width 6mil, minimum drill 0.35mm, track to track 6mil, track to pad 6mil, pad to pad 6mil, via to via 6mil, smd to smd 6mil, copper to edge 40mil, drill to drill 6mil, minimum pad ring 10mil, minimum via ring 8mil, stop-mask expansion 4mil, vias tented up to drill 0mil, thermal gap 10mil

### Footprints (pad centres in the part's own frame; a part is rotated, then mirrored left to right if it is on the bottom)
ANT2-SMD-3.2X1.6X0.5MM = smd 1 x 1.2: 1 -1.6,0; 2 1.6,0
0402 = smd 0.85 x 0.9: 1 -0.58,0; 2 0.58,0
CAPC1005X55N = smd 0.54 x 0.6: 1 -0.43,0; 2 0.43,0
0603 = smd 1.1 x 1: 1 -0.85,0; 2 0.85,0
0402-TIGHT = smd 0.6 x 0.6: 1 -0.5,0; 2 0.5,0
CAPC1608X95N = smd 0.95 x 0.97: 1 -0.76,0; 2 0.76,0
FIL_DEA202450BT-1294C1-H = smd 0.35 x 0.35: 1 0.003,-0.326; 3 0.002,0.323 | smd 0.45 x 1: 2 0.652,-0.002; 4 -0.649,-0.001
QFN40-6X6 = smd 0.95 x 0.28: 1 -3.025,2.25; 2 -3.025,1.75; 3 -3.025,1.25; 4 -3.025,0.75; 5 -3.025,0.25; 6 -3.025,-0.25; 7 -3.025,-0.75; 8 -3.025,-1.25; 9 -3.025,-1.75; 10 -3.025,-2.25; 21 3.025,-2.25; 22 3.025,-1.75; 23 3.025,-1.25; 24 3.025,-0.75; 25 3.025,-0.25; 26 3.025,0.25; 27 3.025,0.75; 28 3.025,1.25; 29 3.025,1.75; 30 3.025,2.25 | smd 0.28 x 0.95: 11 -2.25,-3.025; 12 -1.75,-3.025; 13 -1.25,-3.025; 14 -0.75,-3.025; 15 -0.25,-3.025; 16 0.25,-3.025; 17 0.75,-3.025; 18 1.25,-3.025; 19 1.75,-3.025; 20 2.25,-3.025; 31 2.25,3.025; 32 1.75,3.025; 33 1.25,3.025; 34 0.75,3.025; 35 0.25,3.025; 36 -0.25,3.025; 37 -0.75,3.025; 38 -1.25,3.025; 39 -1.75,3.025; 40 -2.25,3.025 | drill 0.3 pad 1.1 square: EXP@1 -1.525,1.525; EXP@2 -0.5,1.525; EXP@3 0.5,1.525; EXP@4 1.525,1.525; EXP@5 -1.525,0.475; EXP@6 -0.5,0.475; EXP@7 0.5,0.475; EXP@8 1.525,0.475; EXP@9 -1.525,-0.475; EXP@10 -0.5,-0.475; EXP@11 0.5,-0.475; EXP@12 1.525,-0.475; EXP@13 -1.525,-1.525; EXP@14 -0.5,-1.525; EXP@15 0.5,-1.525; EXP@16 1.525,-1.525
TE_5-146282-3 = drill 0.89 square: 1 -2.54,0 | drill 0.89: 2 0,0; 3 2.54,0
AMPHENOL_10118194-0001LF = smd 0.4 x 1.35: 1 -1.3,2.7; 2 -0.65,2.7; 3 0,2.7; 4 0.65,2.7; 5 1.3,2.7 | drill 0.55 pad 0.65 long: S1 -2.5,2.7; S2 2.5,2.7 | drill 0.5 pad 0.775 long: S3 -3.5,0; S6 3.5,0 | smd 1.5 x 1.55: S4 -1,0; S5 1,0
INDC0402X01 = smd 0.7 x 0.9: 1 -0.65,0; 2 0.65,0
INDC1008X04 = smd 0.6 x 2: 1 -0.95,0; 2 0.95,0
INDC1005X45 = smd 0.7 x 0.9: 1 -0.65,0; 2 0.65,0
1X01 = drill 1.016 pad 1.88: 1 0,0
FA-128 = smd 0.95 x 0.85: 1 -0.725,-0.575; 2 0.725,-0.575; 3 0.725,0.575; 4 -0.725,0.575
RESC1005X40 = smd 0.7 x 0.9: 1 -0.65,0; 2 0.65,0
QFN50P900X900X100-65N = smd 0.85 x 0.28: 1 -4.475,3.75; 2 -4.475,3.25; 3 -4.475,2.75; 4 -4.475,2.25; 5 -4.475,1.75; 6 -4.475,1.25; 7 -4.475,0.75; 8 -4.475,0.25; 9 -4.475,-0.25; 10 -4.475,-0.75; 11 -4.475,-1.25; 12 -4.475,-1.75; 13 -4.475,-2.25; 14 -4.475,-2.75; 15 -4.475,-3.25; 16 -4.475,-3.75; 33 4.475,-3.75; 34 4.475,-3.25; 35 4.475,-2.75; 36 4.475,-2.25; 37 4.475,-1.75; 38 4.475,-1.25; 39 4.475,-0.75; 40 4.475,-0.25; 41 4.475,0.25; 42 4.475,0.75; 43 4.475,1.25; 44 4.475,1.75; 45 4.475,2.25; 46 4.475,2.75; 47 4.475,3.25; 48 4.475,3.75 | smd 0.28 x 0.85: 17 -3.75,-4.475; 18 -3.25,-4.475; 19 -2.75,-4.475; 20 -2.25,-4.475; 21 -1.75,-4.475; 22 -1.25,-4.475; 23 -0.75,-4.475; 24 -0.25,-4.475; 25 0.25,-4.475; 26 0.75,-4.475; 27 1.25,-4.475; 28 1.75,-4.475; 29 2.25,-4.475; 30 2.75,-4.475; 31 3.25,-4.475; 32 3.75,-4.475; 49 3.75,4.475; 50 3.25,4.475; 51 2.75,4.475; 52 2.25,4.475; 53 1.75,4.475; 54 1.25,4.475; 55 0.75,4.475; 56 0.25,4.475; 57 -0.25,4.475; 58 -0.75,4.475; 59 -1.25,4.475; 60 -1.75,4.475; 61 -2.25,4.475; 62 -2.75,4.475; 63 -3.25,4.475; 64 -3.75,4.475 | smd 7.3 x 7.3: EXP 0,0
SOIC127P600X175-8N = smd 1.9 x 0.6: 1 -2.455,1.905; 2 -2.455,0.635; 3 -2.455,-0.635; 4 -2.455,-1.905; 5 2.455,-1.905; 6 2.455,-0.635; 7 2.455,0.635; 8 2.455,1.905
QFP80P900X900X120-32N = smd 1.5 x 0.55: 1 -4.3,2.8; 2 -4.3,2; 3 -4.3,1.2; 4 -4.3,0.4; 5 -4.3,-0.4; 6 -4.3,-1.2; 7 -4.3,-2; 8 -4.3,-2.8; 17 4.3,-2.8; 18 4.3,-2; 19 4.3,-1.2; 20 4.3,-0.4; 21 4.3,0.4; 22 4.3,1.2; 23 4.3,2; 24 4.3,2.8 | smd 0.55 x 1.5: 9 -2.8,-4.3; 10 -2,-4.3; 11 -1.2,-4.3; 12 -0.4,-4.3; 13 0.4,-4.3; 14 1.2,-4.3; 15 2,-4.3; 16 2.8,-4.3; 25 2.8,4.3; 26 2,4.3; 27 1.2,4.3; 28 0.4,4.3; 29 -0.4,4.3; 30 -1.2,4.3; 31 -2,4.3; 32 -2.8,4.3
SOT127P706X180-6N = smd 1.97 x 0.62: 1 -3.005,2.54; 2 -3.005,1.27; 3 -3.005,0; 4 -3.005,-1.27; 5 -3.005,-2.54 | smd 1.97 x 3.16: 6 3.005,0
OSCCC320X250X56 = smd 1.21 x 0.96: 1 -1.15,-0.925; 2 1.15,-0.925; 3 1.15,0.925; 4 -1.15,0.925
LEDM1608X80 = smd 0.8 x 0.8: A 0.75,0; C -0.75,0
OSCL550P800X320X254-4N = smd 1.5 x 0.6: 1 -1.575,2.75; 2 -1.575,-2.75; 3 1.575,-2.75; 4 1.575,2.75
XTAL_ABS07-32.768KHZ-T = smd 1.1 x 1.9: 1 -1.25,0; 2 1.25,0

### Placement (x,y rotation side)
ANT1  97.79,53.34 90 top
C1  61.09,22.86 270 top
C2  89.03,48.39 270 top
C3  88.9,35.56 0 top
C4  92.08,38.23 270 top
C5  54.61,49.53 180 top
C6  54.61,46.99 180 top
C7  74.55,45.09 0 top
C8  69.85,34.29 0 top
C9  74.55,46.48 0 top
C10  82.55,44.45 0 top
C11  82.55,39.37 0 top
C12  12.7,52.07 0 top
C13  8.89,48.26 0 top
C14  8.89,44.45 0 top
C15  8.89,40.64 0 top
C16  8.89,36.83 0 top
C17  52.07,58.42 0 top
C18  57.15,35.56 0 top
C19  60.96,63.5 0 top
C20  60.96,59.69 0 top
C21  58.42,31.75 0 top
C22  58.42,26.67 0 top
C23  27.94,71.12 0 top
C24  27.94,67.31 0 top
C25  27.94,55.88 0 top
C26  27.94,52.07 0 top
C27  45.72,66.04 0 top
C28  39.37,69.85 0 top
C29  39.37,58.42 0 top
C101  48.26,66.04 0 top
C211  50.8,66.04 0 top
C221  53.34,66.04 0 top
C231  55.88,66.04 0 top
C241  58.42,66.04 0 top
C251  60.96,66.04 0 top
C252  63.5,66.04 0 top
C253  49.53,62.23 0 top
C261  39.37,62.23 0 top
C262  52.07,62.23 0 top
C271  41.91,62.23 0 top
C272  44.45,62.23 0 top
C311  46.99,62.23 0 top
C321  45.72,69.85 0 top
C331  48.26,69.85 0 top
C391  43.18,69.85 0 top
FL1  77.22,49.02 270 top
IC2  19.05,38.1 0 top
J1  49.53,78.74 0 top
J2  5.08,2.54 0 top
J3  31.75,77.47 0 top
J4  43.18,52.07 0 top
J5  43.18,43.18 0 top
L1  80.01,49.02 0 top
L2  68.2,53.21 90 top
L3  57.15,60.96 0 top
L251  55.88,69.85 0 top
L252  59.69,69.85 0 top
L253  52.07,69.85 0 top
L262  39.37,66.04 0 top
P3SMA_SMD  44.45,26.67 0 top
Q1  36.83,25.4 0 top
R1  78.74,38.1 0 top
R2  80.01,35.56 0 top
R3  80.01,31.75 0 top
R4  57.15,55.88 0 top
R5  52.07,54.61 0 top
R6  57.15,21.59 0 top
R7  57.15,17.78 0 top
R8  57.15,13.97 0 top
R9  57.15,10.16 0 top
R10  27.94,63.5 0 top
R11  27.94,59.69 0 top
R301  43.18,66.04 0 top
U1  67.06,45.85 90 top
U2  67.31,24.13 0 top
U3  -6.35,5.08 0 top
U$1  15.24,6.35 270 top
U$2  88.9,38.1 0 top
U$3  15.24,16.51 90 top
U$4  29.21,48.26 0 top
U$5  29.21,44.45 0 top
Y1  30.48,35.56 0 top
Y2  57.15,48.26 90 top

### Tracks (layer width: path | path; a pad name or v marks a point on that pad's centre or on a via)
32KHZ_N  (2 unrouted)
32KHZ_P  (2 unrouted)
40MHZ_N  (2 unrouted)
40MHZ_P  (2 unrouted)
FEEDBACK  (4 unrouted)
FLASH_CS  (2 unrouted)
FLASH_MISO  (1 unrouted)
FLASH_SPI_CLK  (2 unrouted)
FLASH_SPI_MOSI  (2 unrouted)
GND  (78 unrouted)
HOST_INTR  (1 unrouted)
HOST_SPI_CLK  (1 unrouted)
HOST_SPI_MISO  (1 unrouted)
HOST_SPI_MOSI  (1 unrouted)
HOST_SPI_NCS  (1 unrouted)
N$1
  Top 0.305: 76.96,49.02 71.75,49.02
N$2
  Top 0.305: 77.6,49.02 79.38,49.02
N$3
  Top 0.305: 80.64,49.02 97.92,49.02
N$4
  Top 0.305: 71.5,46.1 73.91,46.48
N$5  (1 unrouted)
N$6  (1 unrouted)
N$7
  Top 0.305: 71.5,45.59 74.04,45.21
N$10  (1 unrouted)
N$11  (1 unrouted)
N$12  (1 unrouted)
N$13  (1 unrouted)
N$14  (2 unrouted)
N$15  (2 unrouted)
N$16  (1 unrouted)
N$17  (1 unrouted)
N$18  (1 unrouted)
N$19  (1 unrouted)
N$20  (1 unrouted)
N$22  (1 unrouted)
N$23  (1 unrouted)
N$24  (1 unrouted)
N$26  (1 unrouted)
N$27  (2 unrouted)
N$28  (2 unrouted)
N$29  (2 unrouted)
N$30  (2 unrouted)
N$31  (1 unrouted)
N$32  (2 unrouted)
N$33  (2 unrouted)
N$34  (1 unrouted)
N$35  (1 unrouted)
P1_0  (1 unrouted)
P1_1  (1 unrouted)
P1_2  (1 unrouted)
P1_3  (1 unrouted)
P1_4  (1 unrouted)
P2_3  (2 unrouted)
P2_4  (2 unrouted)
U1_UART_RX  (1 unrouted)
U1_UART_TX  (1 unrouted)
USB_N  (1 unrouted)
USB_P  (1 unrouted)
V_BATT  (39 unrouted)
V_USB  (1 unrouted)
VCC  (1 unrouted)
VDD_ANA  (7 unrouted)
VDD_DIG_CC  (2 unrouted)
VDD_PA  (4 unrouted)
VIN  (6 unrouted)